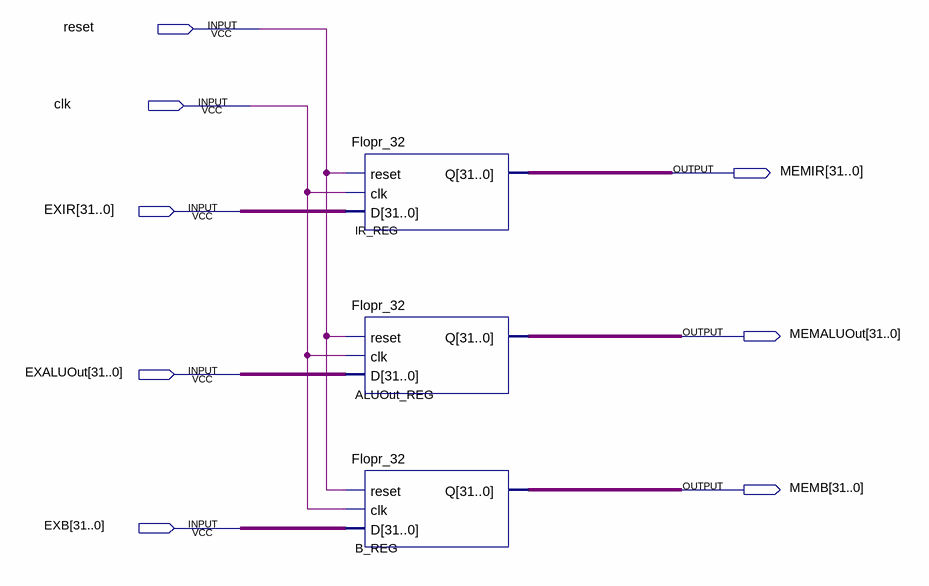
[diagram p0: schematic sheet]
// Quartus schematic EXMEMTower.bdf as structural Verilog: 3 symbols, 8 pins
module EXMEMTower (
  input  reset,
  input  clk,
  input  [31:0] EXIR,
  input  [31:0] EXALUOut,
  input  [31:0] EXB,
  output [31:0] MEMIR,
  output [31:0] MEMALUOut,
  output [31:0] MEMB
);

  Flopr_32 IR_REG (.reset(reset), .clk(clk), .D(EXIR), .Q(MEMIR));
  Flopr_32 ALUOut_REG (.reset(reset), .clk(clk), .D(EXALUOut), .Q(MEMALUOut));
  Flopr_32 B_REG (.reset(reset), .clk(clk), .D(EXB), .Q(MEMB));
endmodule
